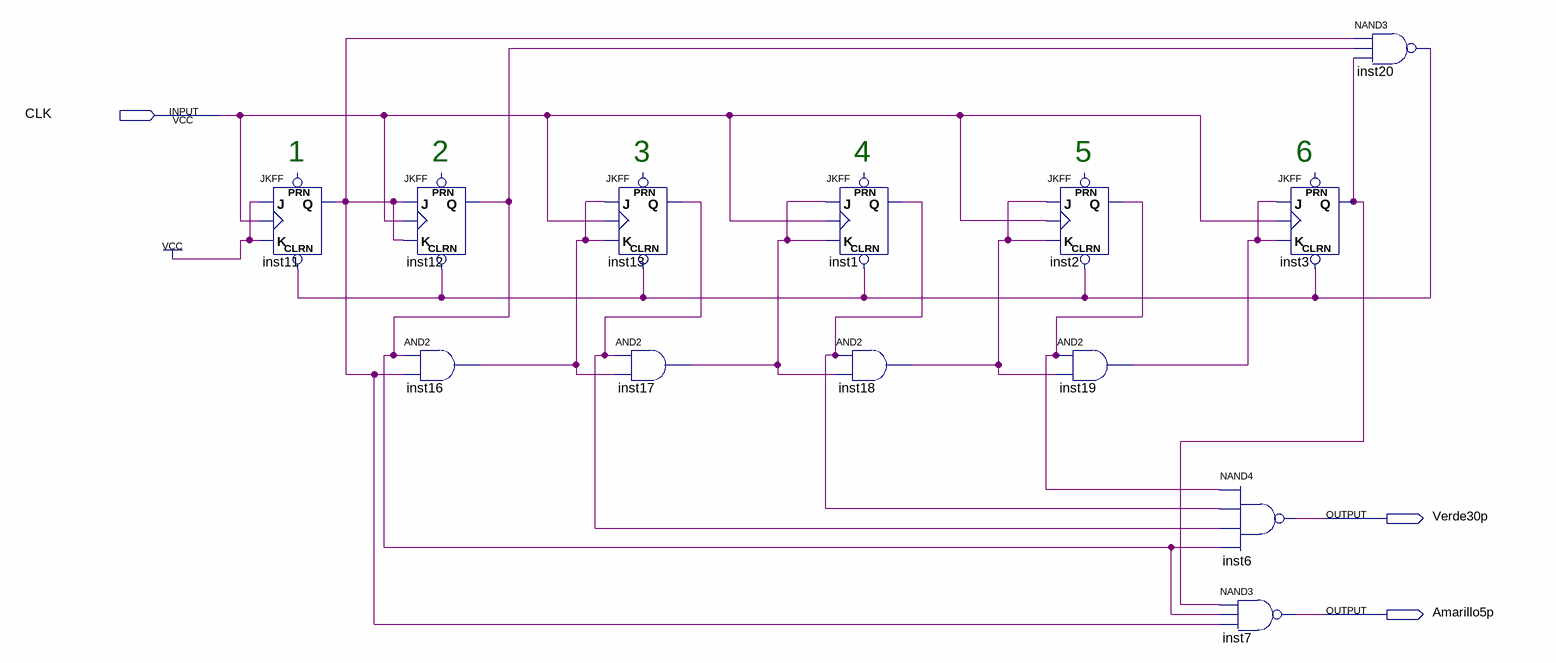
[diagram p0: schematic sheet]
// Quartus schematic Tp2Grupo3-Contador35.bdf as structural Verilog: 13 symbols, 3 pins
module \Tp2Grupo3-Contador35  (
  input  CLK,
  output Verde30p,
  output Amarillo5p
);

  wire inst1_q, inst2_q, inst3_q, inst11_q, inst12_q, inst13_q, inst16_out, inst17_out, inst18_out,
       inst19_out, inst20_out;

  JKFF inst11 (.CLRN(inst20_out), .K(1'b1), .J(1'b1), .CLK(CLK), .Q(inst11_q));  // open: PRN
  JKFF inst12 (.CLRN(inst20_out), .K(inst11_q), .J(inst11_q), .CLK(CLK), .Q(inst12_q));  // open: PRN
  and inst16 (inst16_out, inst12_q, inst11_q);
  JKFF inst13 (.CLRN(inst20_out), .K(inst16_out), .J(inst16_out), .CLK(CLK), .Q(inst13_q));  // open: PRN
  and inst17 (inst17_out, inst13_q, inst16_out);
  JKFF inst1 (.CLRN(inst20_out), .K(inst17_out), .J(inst17_out), .CLK(CLK), .Q(inst1_q));  // open: PRN
  and inst18 (inst18_out, inst1_q, inst17_out);
  JKFF inst2 (.CLRN(inst20_out), .K(inst18_out), .J(inst18_out), .CLK(CLK), .Q(inst2_q));  // open: PRN
  and inst19 (inst19_out, inst2_q, inst18_out);
  JKFF inst3 (.CLRN(inst20_out), .K(inst19_out), .J(inst19_out), .CLK(CLK), .Q(inst3_q));  // open: PRN
  nand inst6 (Verde30p, inst2_q, inst1_q, inst13_q, inst12_q);
  nand inst7 (Amarillo5p, inst3_q, inst12_q, inst11_q);
  nand inst20 (inst20_out, inst11_q, inst12_q, inst3_q);

  // Notes on the sheet:
  //   1
  //   2
  //   3
  //   4
  //   5
  //   6
endmodule
